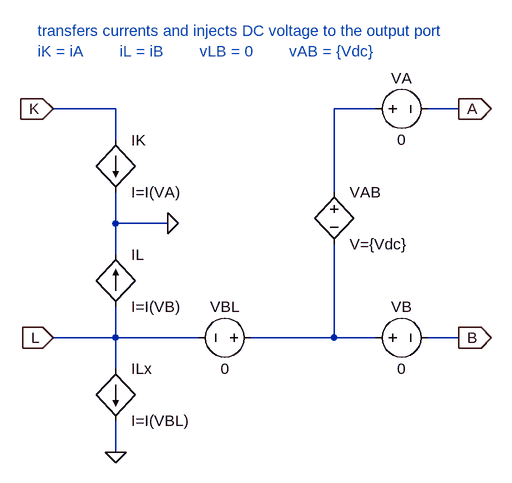
[diagram p0: schematic DC_voltage_injector.asc]
DC_voltage_injector.asc, the LTspice schematic file:
Version 4
SHEET 1 880 720
WIRE 208 64 112 64
WIRE 608 64 544 64
WIRE 736 64 688 64
WIRE 208 112 208 64
WIRE 544 192 544 64
WIRE 208 240 208 192
WIRE 288 240 208 240
WIRE 208 288 208 240
WIRE 208 416 208 368
WIRE 208 416 112 416
WIRE 336 416 208 416
WIRE 544 416 544 272
WIRE 544 416 416 416
WIRE 608 416 544 416
WIRE 736 416 688 416
WIRE 208 464 208 416
WIRE 208 592 208 544
FLAG 736 64 A
IOPIN 736 64 Out
FLAG 736 416 B
IOPIN 736 416 Out
FLAG 112 64 K
IOPIN 112 64 In
FLAG 112 416 L
IOPIN 112 416 In
FLAG 288 240 0
FLAG 208 592 0
SYMBOL bv 544 176 R0
SYMATTR InstName VAB
SYMATTR Value V={Vdc}
SYMBOL bi 208 112 R0
SYMATTR InstName IK
SYMATTR Value I=I(VA)
SYMBOL voltage 592 416 R270
WINDOW 0 32 56 VTop 2
WINDOW 3 -32 56 VBottom 2
SYMATTR InstName VB
SYMATTR Value 0
SYMBOL voltage 432 416 R90
WINDOW 0 -32 56 VBottom 2
WINDOW 3 32 56 VTop 2
SYMATTR InstName VBL
SYMATTR Value 0
SYMBOL voltage 592 64 R270
WINDOW 0 32 56 VTop 2
WINDOW 3 -32 56 VBottom 2
SYMATTR InstName VA
SYMATTR Value 0
SYMBOL bi 208 368 M180
WINDOW 0 24 80 Left 2
WINDOW 3 24 0 Left 2
SYMATTR InstName IL
SYMATTR Value I=I(VB)
SYMBOL bi 208 464 R0
SYMATTR InstName ILx
SYMATTR Value I=I(VBL)
TEXT 88 -56 Left 2 ;transfers currents and injects DC voltage to the output port\niK = iA        iL = iB        vLB = 0        vAB = {Vdc}

The netlist it stands for:
* DC_voltage_injector.asc
B§VAB N001 N002 V={Vdc}
B§IK K 0 I=I(VA)
VB N002 B 0
VBL N002 L 0
VA N001 A 0
B§IL L 0 I=I(VB)
B§ILx L 0 I=I(VBL)
* transfers currents and injects DC voltage to the output port
* iK = iA        iL = iB        vLB = 0        vAB = {Vdc}
.backanno
.end